# EAGLE design LEDBoard (EAGLE 9.7.0)
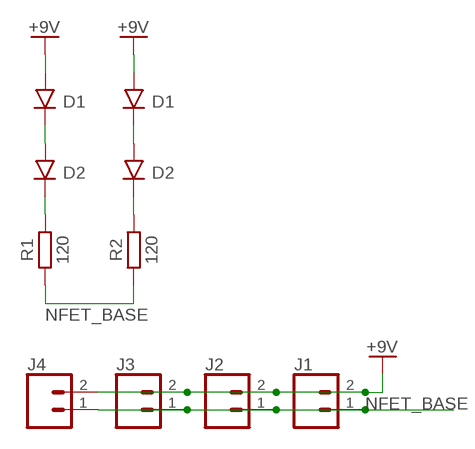
[diagram p0: schematic, sheet 1]

## Parts
D1  JB3030  [JB3030]
D2  JB3030  [JB3030]
D3  JB3030  [JB3030]
D4  JB3030  [JB3030]
J1  CONN_021X02_NO_SILK  [1X02_NO_SILK]
J2  CONN_021X02_NO_SILK  [1X02_NO_SILK]
J3  CONN_021X02_NO_SILK  [1X02_NO_SILK]
J4  CONN_021X02_NO_SILK  [1X02_NO_SILK]
R1  120  R_CHIP-0805(2012-METRIC)  [RESC2012X65]
R2  120  R_CHIP-0805(2012-METRIC)  [RESC2012X65]

## Nets
+9V: D1.A D3.A J1.2 J2.2 J3.2 J4.2
N$1: D1.C D2.A
N$2: D2.C R1.2
N$3: D3.C D4.A
N$4: D4.C R2.2
NFET_BASE: J1.1 J2.1 J3.1 J4.1 R1.1 R2.1

## Library data of the parts
D1-D4 = JB3030:JB3030
J1-J4 = SparkFun-Connectors:CONN_02: Multi connection point. Often used as Generic Header-pin footprint for 0.1 inch spaced/style header connections On any of the 0.1 inch spaced packages, you can populate with these: Break Away Headers - Straight <https://www.sparkfun.com/products/116> (PRT-00116) Break Away Male Headers - Right Angle <https://www.sparkfun.com/products/553> (PRT-00553) Female Headers <https://www.sparkfun.com/products/115> (PRT-00115) Break Away Headers - Machine Pin <https://www.sparkfun.com/products/117> (PRT-00117) Break Away Female Headers - Swiss Machine Pin <https://www.sparkfun.com/products/743> (PRT-00743) For SCREWTERMINALS and SPRING TERMINALS visit here: Screw Terimnals on SparkFun.com <https://www.sparkfun.com/search/results?term=Screw+Terminals> (5mm/3.5mm/2.54mm spacing) This device is also useful as a general connection point to wire up your design to another part of your project. Our various solder wires solder well into these plated through hole pads. Hook-Up Wire - Assortment (Stranded, 22 AWG) <https://www.sparkfun.com/products/11375> (PRT-11375) Hook-Up Wire - Assortment (Solid Core, 22 AWG) <https://www.sparkfun.com/products/11367> (PRT-11367) View the entire wire category on our website here <https://www.sparkfun.com/categories/141> Special notes: Molex polarized connector foot print use with: PRT-08233 with associated crimp pins and housings. 2.54_SCREWTERM for use with PRT-10571. 3.5mm Screw Terminal footprints for PRT-08084 5mm Screw Terminal footprints for use with PRT-08432
R1 R2 = Resistor:R: Resistor Fixed - Generic; CATEGORY: Resistor; SUB-CATEGORY: Fixed

## Board
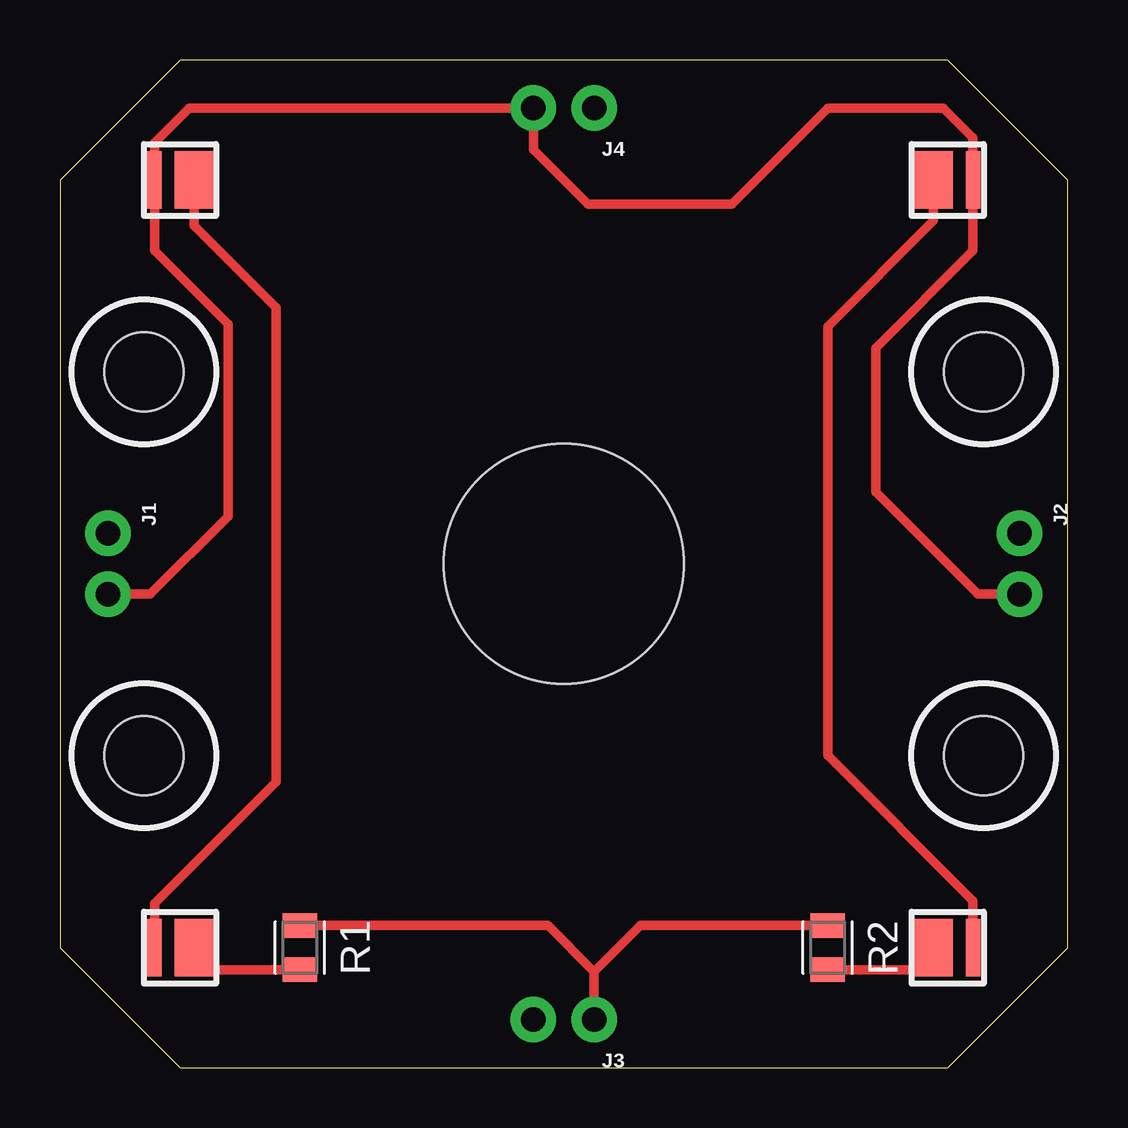
[diagram p1: board, top side]
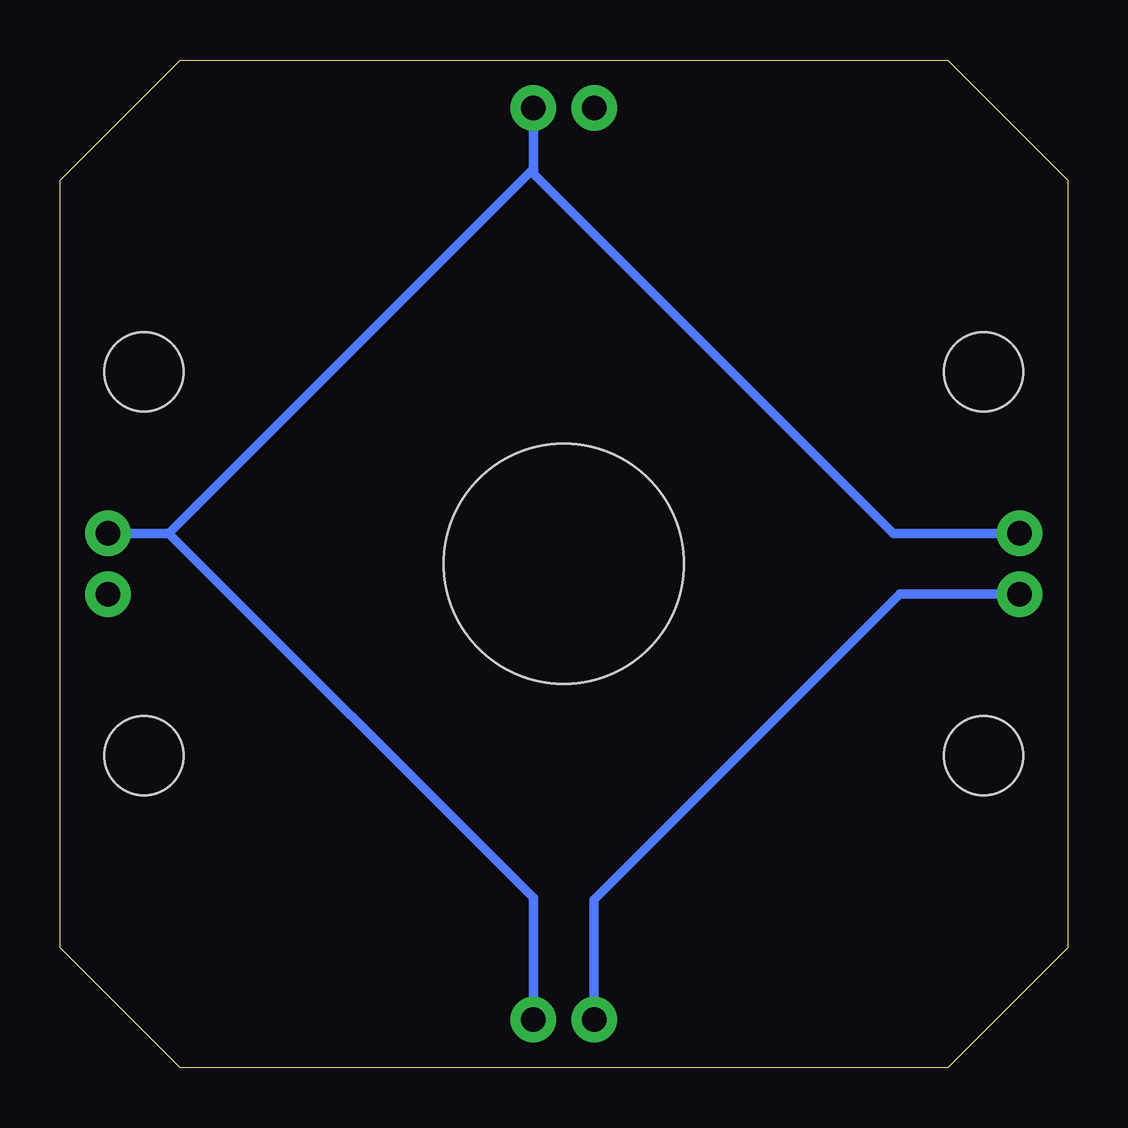
[diagram p2: board, bottom side, seen from below]

Size 42 x 42 mm. Coordinates in mm from the lower left corner, seen from the top.
Outline: 0,37 0,5 5,0 37,0 42,5 42,37 37,42 5,42 0,37
Copper layers (1*16): Top 0.035mm / dielectric 1.5mm / Bottom 0.035mm
Design rules "Fusion Electronics Design Rules": minimum track width 6mil, minimum drill 0.35mm, track to track 6mil, track to pad 6mil, pad to pad 6mil, via to via 6mil, smd to smd 6mil, copper to edge 40mil, drill to drill 6mil, minimum pad ring 10mil, minimum via ring 8mil, stop-mask expansion 4mil, vias tented up to drill 0mil, thermal gap 10mil
Holes 3.3 mm at 3.5,29 38.5,29 38.5,13 3.5,13
Holes 10 mm at 21,21

### Footprints (pad centres in the part's own frame; a part is rotated, then mirrored left to right if it is on the bottom)
JB3030 = smd 0.6 x 2.4: A 1.06,0 | smd 1.6 x 2.4: C -0.585,0
1X02_NO_SILK = drill 1.016 pad 1.88: 1 0,0; 2 2.54,0
RESC2012X65 = smd 1.031 x 1.42: 1 -0.919,0; 2 0.919,0

### Placement (x,y rotation side)
D1  5,37 180 top
D2  5,5 180 top
D3  37,37 0 top
D4  37,5 0 top
J1  2,22.27 270 top
J2  40,22.27 270 top
J3  22.27,2 180 top
J4  22.27,40 180 top
R1  10,5 270 top
R2  32,5 270 top

### Tracks (layer width: path | path; a pad name or v marks a point on that pad's centre or on a via)
+9V
  Top 0.4: J1.2 3.75,19.73 7,22.98 7,31 3.94,34.06 D1.A 3.94,38.55 5.39,40 J4.2 19.73,38.27 22,36 28,36 32,40 36.81,40 38.06,38.75 D3.A 38.06,34.06 34,30 34,24 38.27,19.73 J2.2
  Bottom 0.4: J1.2 7,19.73 19.73,7 J3.2
N$1
  Top 0.4: D1.C 5.59,35.1 9,31.69 9,27 9,11.91 3.94,6.85 D2.A
N$2
  Top 0.4: D2.C 6.51,4.08 R1.2
N$3
  Top 0.4: D3.C 36.41,35.3 32,30.88 32,26 32,13.01 38.06,6.95 D4.A
N$4
  Top 0.4: D4.C 35.49,4.08 R2.2
NFET_BASE
  Top 0.4: 22.27,4 24.19,5.92 R2.1 | 22.27,4 J3.1 | 22.27,4 20.35,5.92 R1.1
  Bottom 0.4: J3.1 22.27,6.71 22.27,7.08 37.46,22.27 | J1.1 7.27,22.27 22.27,37.27 J4.1 22.27,37.46 36.37,23.37 37.46,22.27 | 37.46,22.27 J2.1